# EAGLE design oscillators (EAGLE 6.4)
PROJECT: RGB_driver
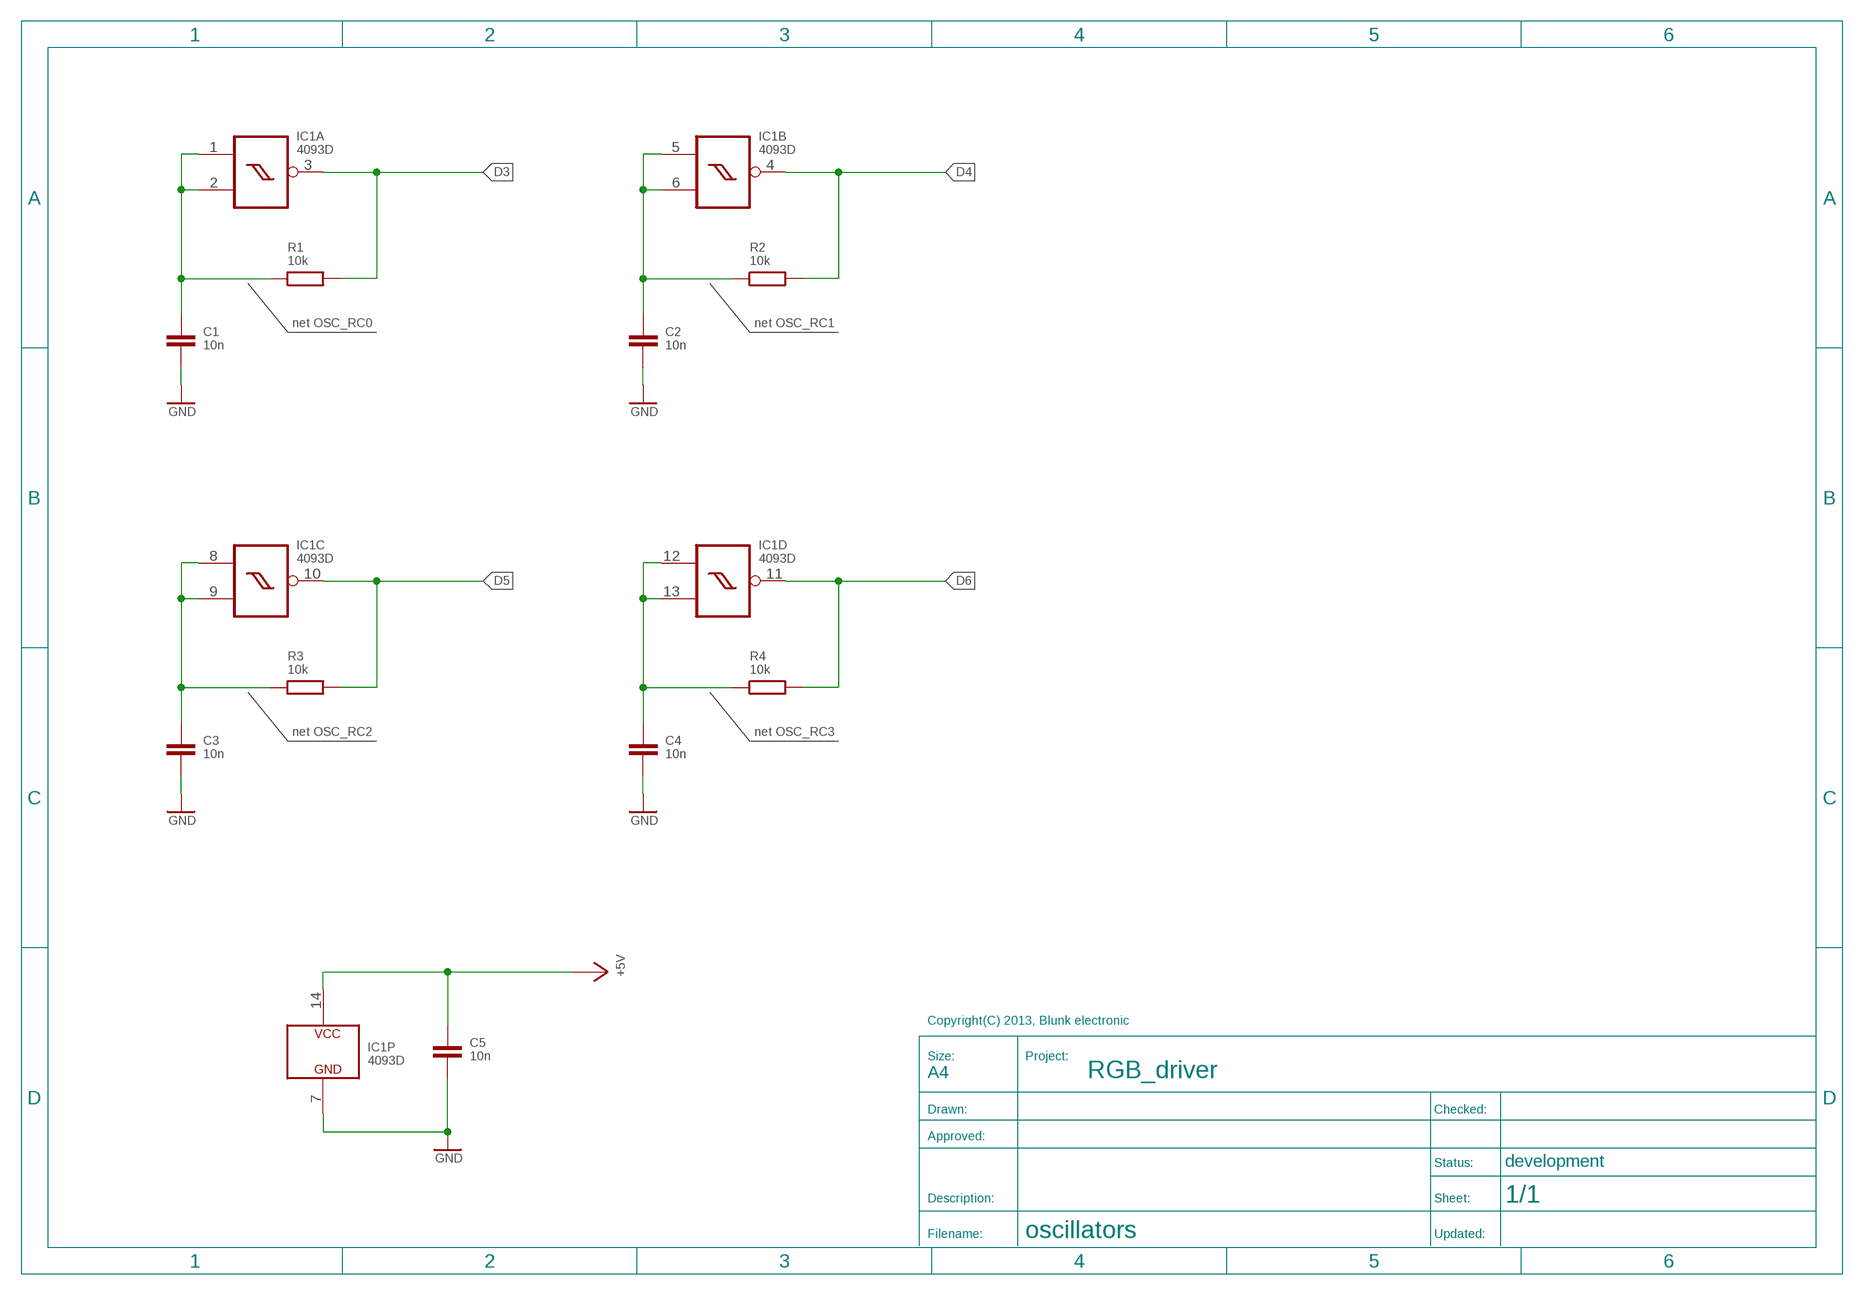
[diagram p0: schematic, sheet 1]
U$1 (A4_LANDSCAPE_DEVELOPMENT): COMMISSIONED: 2013-03-26

## Parts
C1  10n  C_EU_S_0805  [S_0805]
C2  10n  C_EU_S_0805  [S_0805]
C3  10n  C_EU_S_0805  [S_0805]
C4  10n  C_EU_S_0805  [S_0805]
C5  10n  C_EU_S_0805  [S_0805]
IC1  4093D  [S_SO14]
R1  10k  R_EU_S_0805  [S_0805]
R2  10k  R_EU_S_0805  [S_0805]
R3  10k  R_EU_S_0805  [S_0805]
R4  10k  R_EU_S_0805  [S_0805]

## Nets
+5V [PWR]: C5.1 IC1.14(P:VCC)
D3: IC1.3(A:O) R1.2
D4: IC1.4(B:O) R2.2
D5: IC1.10(C:O) R3.2
D6: IC1.11(D:O) R4.2
GND [PWR]: C1.2 C2.2 C3.2 C4.2 C5.2 IC1.7(P:GND)
OSC_RC0: C1.1 IC1.1(A:I0) IC1.2(A:I1) R1.1
OSC_RC1: C2.1 IC1.5(B:I0) IC1.6(B:I1) R2.1
OSC_RC2: C3.1 IC1.8(C:I0) IC1.9(C:I1) R3.1
OSC_RC3: C4.1 IC1.12(D:I0) IC1.13(D:I1) R4.1

## Notes on the sheet
- net OSC_RC0 | net OSC_RC1
- net OSC_RC2 | net OSC_RC3

## Library data of the parts
C1-C5 = be_rcl:C_EU: Capacitor Device EU drawn: Mario Blunk / Blunk electronic
IC1 = be_logic:4093: Quad 2-input NAND with schmitt trigger inputs drawn: Mario Blunk / Blunk electronic; COMMISSIONED: 2013-05-06
R1-R4 = be_rcl:R_EU: Resistor Device EU drawn: Mario Blunk / Blunk electronic

## Net classes
1 PWR: width 0.254 mm

## Board
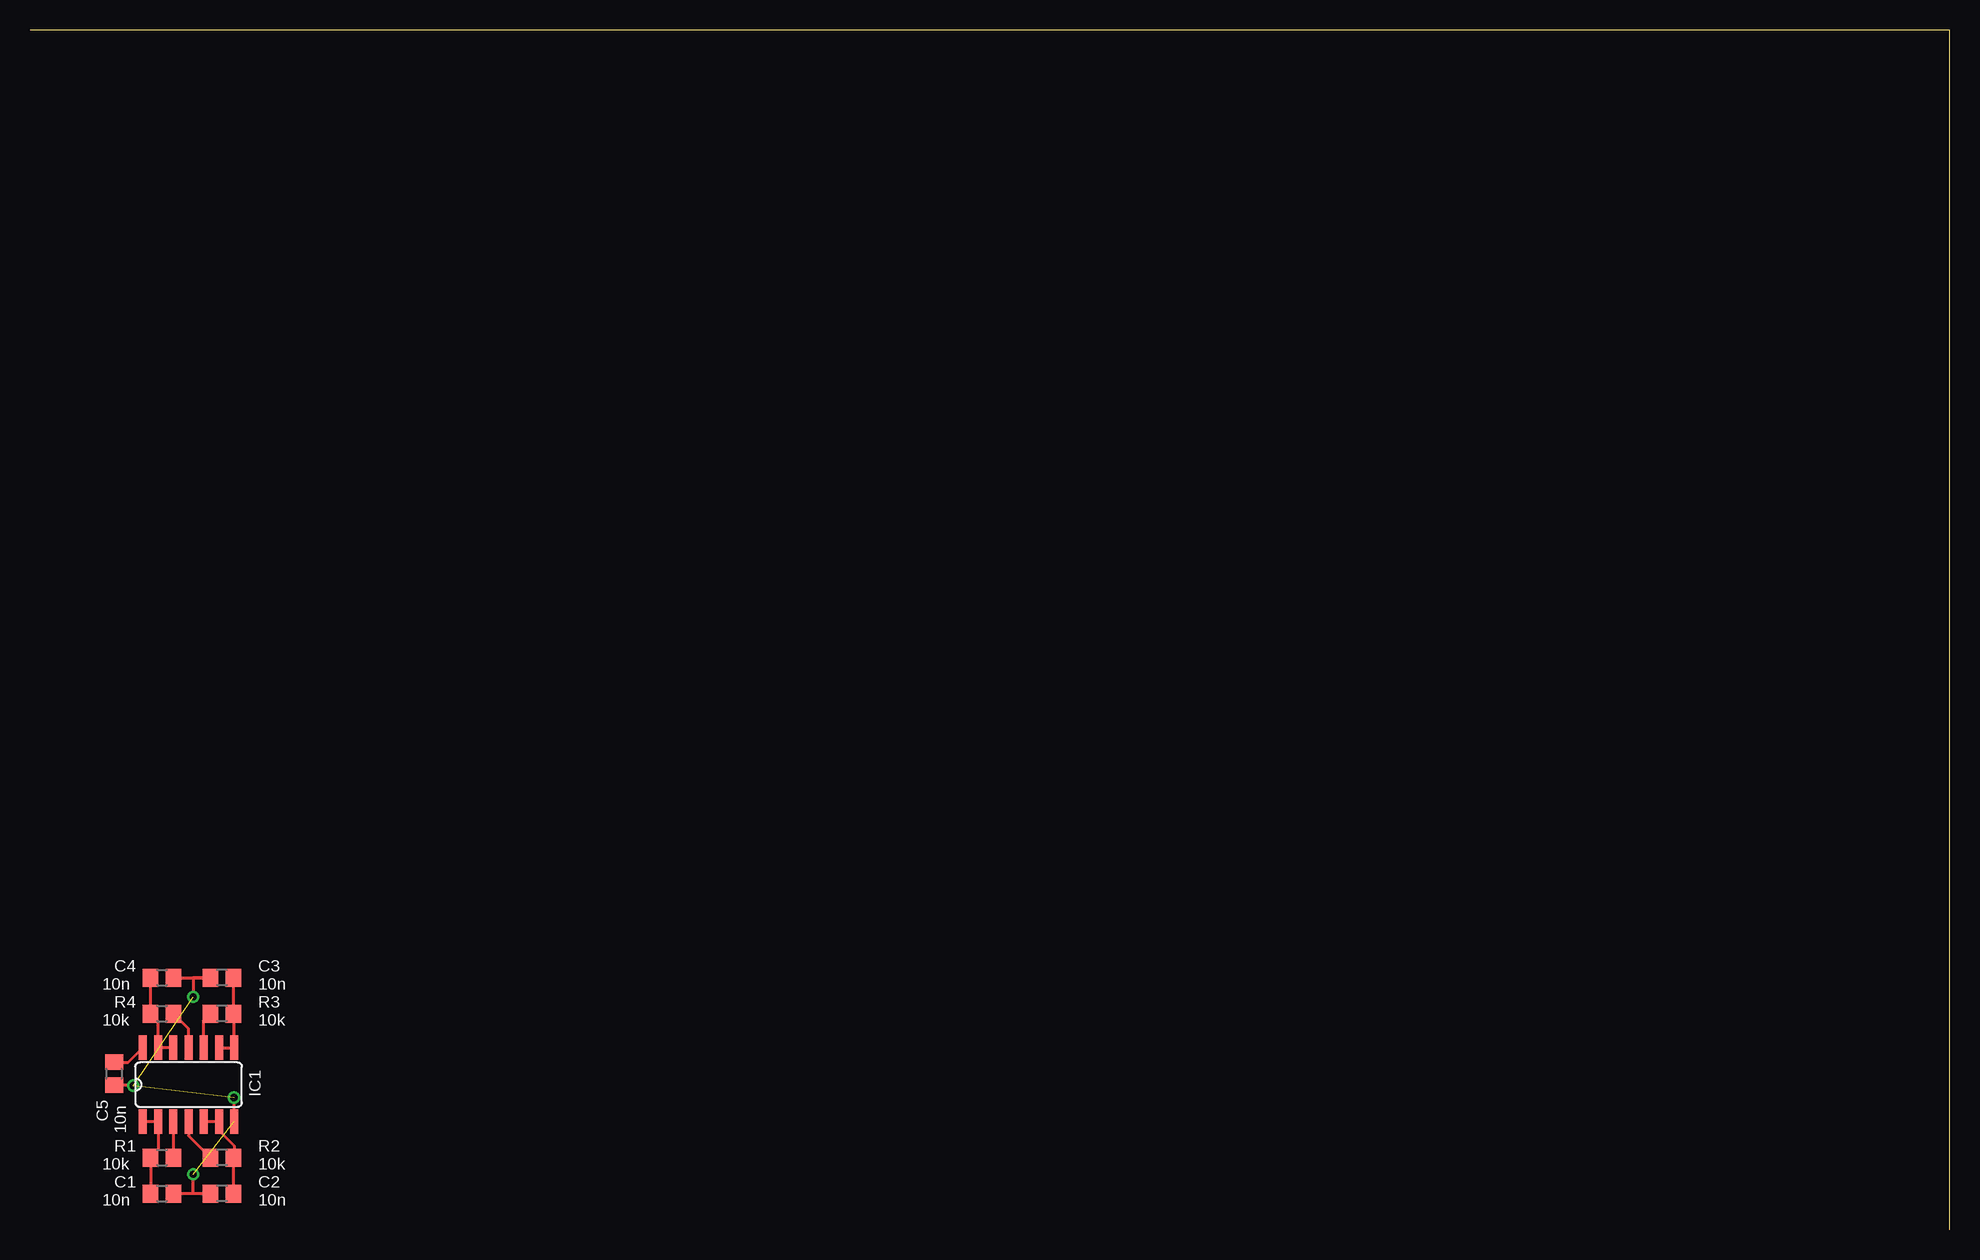
[diagram p1: board, top side]

Size 160 x 100 mm. Coordinates in mm from the lower left corner, seen from the top.
Outline: 160,0 160,100 0,100
Copper layers (1*16): Top 0.035mm / dielectric 1.5mm / Bottom 0.035mm
Design rules "default": minimum track width 10mil, minimum drill 0.6mm, track to track 8mil, track to pad 8mil, pad to pad 8mil, via to via 8mil, smd to smd 8mil, copper to edge 40mil, drill to drill 8mil, minimum pad ring 10mil, minimum via ring 8mil, stop-mask expansion 4mil, vias tented up to drill 0mil, thermal gap 10mil

### Footprints (pad centres in the part's own frame; a part is rotated, then mirrored left to right if it is on the bottom)
S_0805 = smd 1.3 x 1.5: 1 -0.95,0; 2 0.95,0
S_SO14 = smd 0.66 x 2.032: 1 -3.81,-3.073; 2 -2.54,-3.073; 3 -1.27,-3.073; 4 0,-3.073; 5 1.27,-3.073; 6 2.54,-3.073; 7 3.81,-3.073; 8 3.81,3.073; 9 2.54,3.073; 10 1.27,3.073; 11 0,3.073; 12 -1.27,3.073; 13 -2.54,3.073; 14 -3.81,3.073

### Placement (x,y rotation side)
C1  11,3 0 top
C2  16,3 180 top
C3  16,21 180 top
C4  11,21 0 top
C5  7,13 270 top
IC1  13.22,12.08 0 top
R1  11,6 0 top
R2  16,6 180 top
R3  16,18 180 top
R4  11,18 0 top

### Tracks (layer width: path | path; a pad name or v marks a point on that pad's centre or on a via)
+5V
  Top 0.254: C5.1 8.21,13.95 IC1.14
D3
  Top 0.254: IC1.3 R1.2
D4
  Top 0.254: IC1.4 13.22,7.83 R2.2
D5
  Top 0.254: IC1.10 14.49,17.44 R3.2
D6
  Top 0.254: IC1.11 13.22,16.73 R4.2
GND  (via drill 0.6)  (3 unrouted)
  Top 0.254: C4.2 C3.2 13.6,21 v13.6,19.4 | C1.2 C2.2 13.6,3 v13.6,4.6 | IC1.7 17.03,10.97 v17,11 | C5.2 8.6,12.05 v8.6,12
OSC_RC0
  Top 0.254: IC1.1 IC1.2 10.68,6.63 R1.1 C1.1
OSC_RC1
  Top 0.254: IC1.5 IC1.6 15.76,8.24 17,7 17,6.05 R2.1 C2.1
OSC_RC2
  Top 0.254: IC1.9 IC1.8 17.03,17.92 R3.1 C3.1
OSC_RC3
  Top 0.254: IC1.12 IC1.13 10.68,17.37 R4.1 C4.1